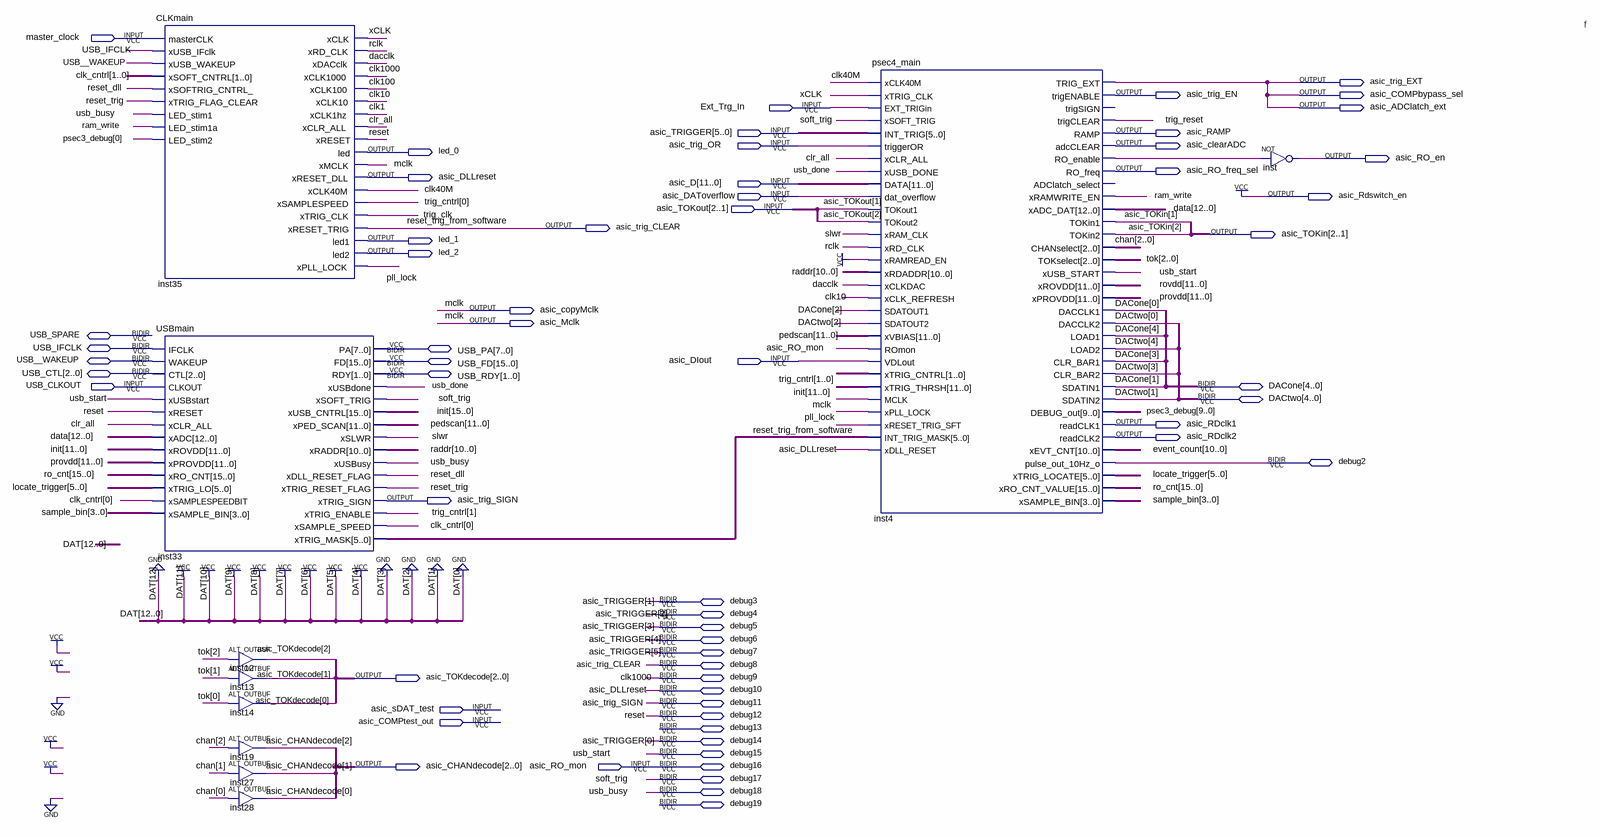
[diagram p0: schematic sheet]
// Quartus schematic PSEC4_eval.bdf as structural Verilog: 10 symbols, 61 pins
module PSEC4_eval (
  input  master_clock,
  input  Ext_Trg_In,
  input  [5:0] asic_TRIGGER,
  input  asic_trig_OR,
  input  [11:0] asic_D,
  input  asic_DAToverflow,
  input  [2:1] asic_TOKout,
  input  asic_DIout,
  input  USB_CLKOUT,
  input  asic_sDAT_test,
  input  asic_COMPtest_out,
  input  asic_RO_mon,
  inout  USB_SPARE,
  inout  USB_IFCLK,
  inout  [7:0] USB_PA,
  inout  USB__WAKEUP,
  inout  [15:0] USB_FD,
  inout  [2:0] USB_CTL,
  inout  [1:0] USB_RDY,
  inout  [4:0] DACone,
  inout  [4:0] DACtwo,
  inout  debug2,
  inout  debug3,
  inout  debug4,
  inout  debug5,
  inout  debug6,
  inout  debug7,
  inout  debug8,
  inout  debug9,
  inout  debug10,
  inout  debug11,
  inout  debug12,
  inout  debug13,
  inout  debug14,
  inout  debug15,
  inout  debug16,
  inout  debug17,
  inout  debug18,
  inout  debug19,
  output asic_trig_EXT,
  output asic_trig_EN,
  output asic_COMPbypass_sel,
  output asic_ADClatch_ext,
  output asic_RAMP,
  output asic_clearADC,
  output led_0,
  output asic_RO_en,
  output asic_RO_freq_sel,
  output asic_DLLreset,
  output asic_Rdswitch_en,
  output asic_trig_CLEAR,
  output [2:1] asic_TOKin,
  output led_1,
  output led_2,
  output asic_copyMclk,
  output asic_Mclk,
  output asic_RDclk1,
  output asic_RDclk2,
  output asic_trig_SIGN,
  output [2:0] asic_TOKdecode,
  output [2:0] asic_CHANdecode
);

  wire clk1, clk10, clk40M, clk100, clr_all, dacclk, inst4_ro_enable, pll_lock, ram_write, rclk, reset_dll,
       reset_trig, slwr, trig_clk, trig_reset, usb_done, xCLK;
  wire [1:0] clk_cntrl, trig_cntrl;
  wire [2:0] chan, tok;
  wire [3:0] sample_bin;
  wire [5:0] inst33_xtrig_mask, locate_trigger;
  wire [9:0] psec3_debug;
  wire [10:0] event_count, raddr;
  wire [11:0] pedscan, provdd, rovdd;
  wire [12:0] data;
  wire [15:0] init, ro_cnt;

  CLKmain inst35 (
    .masterCLK(master_clock), .xUSB_IFclk(USB_IFCLK), .xUSB_WAKEUP(USB__WAKEUP), .xSOFT_CNTRL(clk_cntrl),
    .xSOFTRIG_CNTRL_(reset_dll), .xTRIG_FLAG_CLEAR(reset_trig), .LED_stim1(debug18), .LED_stim1a(ram_write),
    .LED_stim2(psec3_debug[0]), .xCLK(xCLK), .xRD_CLK(rclk), .xDACclk(dacclk), .xCLK1000(debug9),
    .xCLK100(clk100), .xCLK10(clk10), .xCLK1hz(clk1), .xCLR_ALL(clr_all), .xRESET(debug12), .led(led_0),
    .xMCLK(asic_copyMclk), .xRESET_DLL(debug10), .xCLK40M(clk40M), .xSAMPLESPEED(trig_cntrl[0]),
    .xTRIG_CLK(trig_clk), .xRESET_TRIG(debug8), .led1(led_1), .led2(led_2), .xPLL_LOCK(pll_lock));
  USBmain inst33 (
    .IFCLK(USB_IFCLK), .WAKEUP(USB__WAKEUP), .CTL(USB_CTL), .CLKOUT(USB_CLKOUT), .xUSBstart(debug15),
    .xRESET(debug12), .xCLR_ALL(clr_all), .xADC(data), .xROVDD(init[11:0]), .xPROVDD(provdd),
    .xRO_CNT(ro_cnt), .xTRIG_LO(locate_trigger), .xSAMPLESPEEDBIT(clk_cntrl[0]), .xSAMPLE_BIN(sample_bin),
    .RDY(USB_RDY), .xUSBdone(usb_done), .xSOFT_TRIG(debug17), .xUSB_CNTRL(init), .xPED_SCAN(pedscan),
    .xSLWR(slwr), .xRADDR(raddr), .xUSBusy(debug18), .xDLL_RESET_FLAG(reset_dll),
    .xTRIG_RESET_FLAG(reset_trig), .xTRIG_SIGN(debug11), .xTRIG_ENABLE(trig_cntrl[1]),
    .xSAMPLE_SPEED(clk_cntrl[0]), .xTRIG_MASK(inst33_xtrig_mask), .PA(USB_PA), .FD(USB_FD));
  ALT_OUTBUF inst12 (.i(tok[2]), .o(asic_TOKdecode[2]));
  ALT_OUTBUF inst13 (.i(tok[1]), .o(asic_TOKdecode[1]));
  ALT_OUTBUF inst14 (.i(tok[0]), .o(asic_TOKdecode[0]));
  ALT_OUTBUF inst19 (.i(chan[2]), .o(asic_CHANdecode[2]));
  ALT_OUTBUF inst27 (.i(chan[1]), .o(asic_CHANdecode[1]));
  ALT_OUTBUF inst28 (.i(chan[0]), .o(asic_CHANdecode[0]));
  psec4_main inst4 (
    .xCLK40M(clk40M), .xTRIG_CLK(xCLK), .EXT_TRIGin(Ext_Trg_In), .xSOFT_TRIG(debug17),
    .INT_TRIG(asic_TRIGGER), .triggerOR(asic_trig_OR), .xCLR_ALL(clr_all), .xUSB_DONE(usb_done),
    .DATA(asic_D), .dat_overflow(asic_DAToverflow), .TOKout1(asic_TOKout[1]), .TOKout2(asic_TOKout[2]),
    .xRAM_CLK(slwr), .xRD_CLK(rclk), .xRAMREAD_EN(1'b1), .xRDADDR(raddr), .xCLKDAC(dacclk),
    .xCLK_REFRESH(clk10), .SDATOUT1(DACone[2]), .SDATOUT2(DACtwo[2]), .xVBIAS(pedscan), .ROmon(asic_RO_mon),
    .VDLout(asic_DIout), .xTRIG_CNTRL(trig_cntrl), .xTRIG_THRSH(init[11:0]), .MCLK(asic_copyMclk),
    .xPLL_LOCK(pll_lock), .xRESET_TRIG_SFT(debug8), .INT_TRIG_MASK(inst33_xtrig_mask), .xDLL_RESET(debug10),
    .TRIG_EXT(asic_ADClatch_ext), .trigENABLE(asic_trig_EN), .trigCLEAR(trig_reset), .RAMP(asic_RAMP),
    .adcCLEAR(asic_clearADC), .RO_enable(inst4_ro_enable), .RO_freq(asic_RO_freq_sel),
    .xRAMWRITE_EN(ram_write), .xADC_DAT(data), .TOKin1(asic_TOKin[1]), .TOKin2(asic_TOKin[2]),
    .CHANselect(chan), .TOKselect(tok), .xUSB_START(debug15), .xROVDD(rovdd), .xPROVDD(provdd),
    .DACCLK1(DACone[0]), .DACCLK2(DACtwo[0]), .LOAD1(DACone[4]), .LOAD2(DACtwo[4]), .CLR_BAR1(DACone[3]),
    .CLR_BAR2(DACtwo[3]), .SDATIN1(DACone[1]), .SDATIN2(DACtwo[1]), .DEBUG_out(psec3_debug),
    .readCLK1(asic_RDclk1), .readCLK2(asic_RDclk2), .xEVT_CNT(event_count), .pulse_out_10Hz_o(debug2),
    .xTRIG_LOCATE(locate_trigger), .xRO_CNT_VALUE(ro_cnt), .xSAMPLE_BIN(sample_bin));  // open: trigSIGN, ADClatch_select
  not inst (asic_RO_en, inst4_ro_enable);

  assign asic_COMPbypass_sel = asic_ADClatch_ext;
  assign asic_DLLreset = debug10;
  assign asic_Mclk = asic_copyMclk;
  assign asic_Rdswitch_en = 1'b1;
  assign asic_trig_CLEAR = debug8;
  assign asic_trig_EXT = asic_ADClatch_ext;
  assign asic_trig_SIGN = debug11;
  assign debug3 = asic_TRIGGER[1];
  assign debug4 = asic_TRIGGER[2];
  assign debug5 = asic_TRIGGER[3];
  assign debug6 = asic_TRIGGER[4];
  assign debug7 = asic_TRIGGER[5];
  assign debug14 = asic_TRIGGER[0];
  assign debug16 = asic_RO_mon;

  // Other names for the same wires on the sheet: clk1000 = debug9; mclk = asic_copyMclk; reset = debug12;
  //   reset_trig_from_software = debug8; soft_trig = debug17; usb_busy = debug18; usb_start = debug15

  // Notes on the sheet:
  //   f
endmodule
